# Altium project 飞思卡尔.PrjPCB
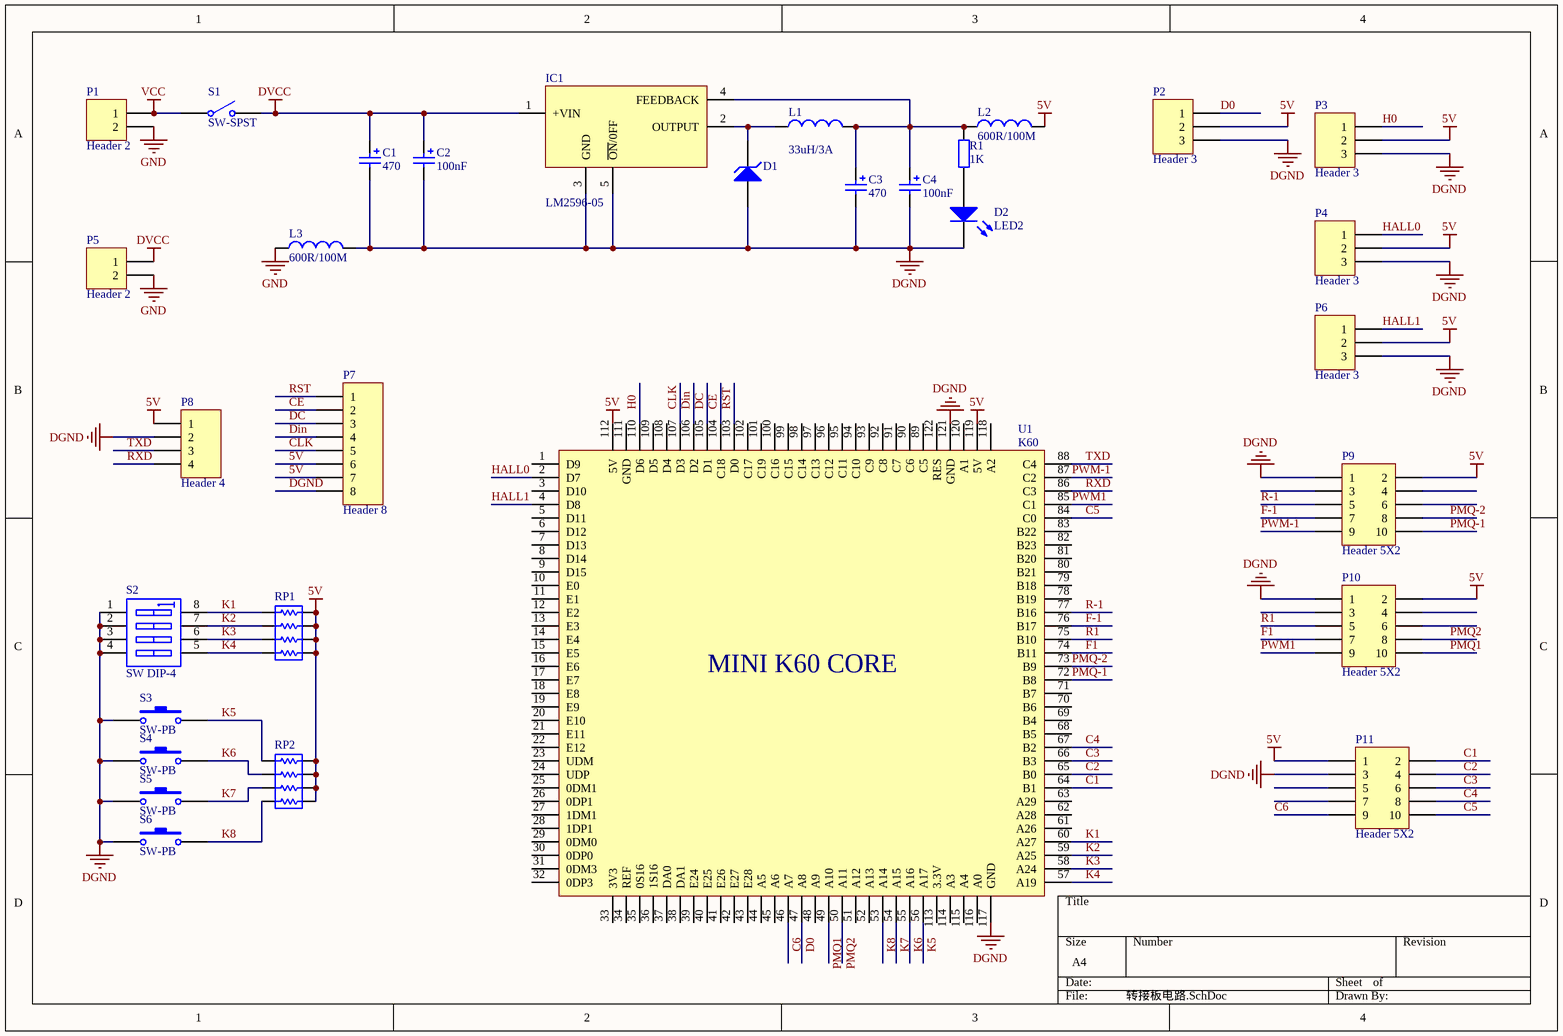
[diagram p0: 转接板电路.SchDoc]
1 sheet, 31 parts. Net scope: global (net labels, ports and power ports of the same name join across sheets).
Board file: 转接板PCB.PcbDoc

## Sheet 转接板电路.SchDoc
size A4

### Parts
C1  470  [ccc]
C2  value 100nF  [C0805]
C3  470  [ccc]
C4  value 100nF  [C0805]
D1  D Zener  [D1810]  (value not drawn)
D2  LED2  [D0805]
IC1  LM2596-05  [TO-263-5]
L1  value 33uH/3A  [L-12*12MM-S]  (hidden comment: Inductor)
L2  value 600R/100M  [L1206]  (hidden comment: Inductor)
L3  value 600R/100M  [L1206]  (hidden comment: Inductor)
P1  Header 2  [SIP2-1]
P2  Header 3  [SIP3]
P3  Header 3  [SIP3]
P4  Header 3  [SIP3]
P5  Header 2  [SIP2-1]
P6  Header 3  [SIP3]
P7  Header 8  [SIP8]
P8  Header 4  [SIP4]
P9  Header 5X2  [SIP10]
P10  Header 5X2  [SIP10]
P11  Header 5X2  [SIP10]
R1  value 1K  [R0805]  (hidden comment: Res2)
RP1  R  PAIZU  [8P4R-0805]  (value not drawn)
RP2  R  PAIZU  [8P4R-0805]  (value not drawn)
S1  SW-SPST  [PCBComponent_1]
S2  SW DIP-4  [BM-SW-4]
S3  SW-PB  [SW-SMD1]
S4  SW-PB  [SW-SMD1]
S5  SW-PB  [SW-SMD1]
S6  SW-PB  [SW-SMD1]
U1  K60  [K60-MK]

### Nets
5V: L2.2 P2.2 P3.2 P4.2 P6.2 P7.6 P7.7 P8.1 P9.2 P10.2 P11.1 RP1.5 RP1.6 RP1.7 RP1.8 RP2.5 RP2.6 RP2.7 RP2.8 U1.112(5V) U1.119(5V)
DGND: C1.2 C2.2 C3.2 C4.2 D1.1(A) D2.2(K) IC1.3(GND) IC1.5(~{ON}/0FF) L3.2 P2.3 P3.3 P4.3 P6.3 P7.8 P8.2 P9.1 P10.1 P11.3 S2.1(A1) S2.2(A2) S2.3(A3) S2.4(A4) S3.1 S4.1 S5.1 S6.1 U1.117(GND) U1.121(GND)
DVCC: C1.1 C2.1 IC1.1(+VIN) P5.1 S1.2(NO)
GND: L3.1 P1.2 P5.2
VCC: P1.1 S1.1(COMMON)
C1: P11.2 U1.64(B1)
C2: P11.4 U1.65(B0)
C3: P11.6 U1.66(B3)
C4: P11.8 U1.67(B2)
C5: P11.10 U1.84(C0)
C6: P11.9 U1.46(A7)
CE: P7.2 U1.104(C18)
CLK: P7.5 U1.107(D3)
D0: P2.1 U1.47(A8)
DC: P7.3 U1.105(D1)
Din: P7.4 U1.106(D2)
F1: P10.7 U1.74(B11)
F-1: P9.7 U1.76(B17)
H0: P3.1 U1.110(D6)
HALL0: P4.1 U1.2(D7)
HALL1: P6.1 U1.4(D8)
K1: RP1.1 S2.8(B1) U1.60(A27)
K2: RP1.2 S2.7(B2) U1.59(A25)
K3: RP1.3 S2.6(B3) U1.58(A24)
K4: RP1.4 S2.5(B4) U1.57(A19)
K5: RP2.1 S3.2 U1.56(A17)
K6: RP2.2 S4.2 U1.55(A16)
K7: RP2.3 S5.2 U1.54(A15)
K8: RP2.4 S6.2 U1.53(A14)
PMQ1: P10.10 U1.49(A10)
PMQ2: P10.8 U1.50(A11)
PMQ-1: P9.10 U1.72(B8)
PMQ-2: P9.8 U1.73(B9)
PWM1: P10.9 U1.85(C1)
PWM-1: P9.9 U1.87(C2)
R1: P10.5 U1.75(B10)
R-1: P9.5 U1.77(B16)
RST: P7.1 U1.103(D0)
RXD: P8.4 U1.86(C3)
TXD: P8.3 U1.88(C4)
NetC3_1: C3.1 C4.1 IC1.4(FEEDBACK) L1.2 L2.1 R1.1
NetD1_2: D1.2(K) IC1.2(OUTPUT) L1.1
NetD2_1: D2.1(A) R1.2

Not connected (* = marked no-connect by the designer): P9 3 4 6; P10 3 4 6; P11 5 7; U1 1(D9) 3(D10) 5(D11) 6(D12) 7(D13) 8(D14) 9(D15) 10(E0) 11(E1) 12(E2) 13(E3) 14(E4) 15(E5) 16(E6) 17(E7) 18(E8) 19(E9) 20(E10) 21(E11) 22(E12) 23(UDM) 24(UDP) 25(0DM1) 26(0DP1) 27(1DM1) 28(1DP1) 29(0DM0) 30(0DP0) 31(0DM3) 32(0DP3) 33(3V3) 34(REF) 35(0S16) 36(1S16) 37(DA0) 38(DA1) 39(E24) 40(E25) 41(E26) 42(E27) 43(E28) 44(A5) 45(A6) 48(A9) 51(A12) 52(A13) 61(A26) 62(A28) 63(A29) 68(B5) 69(B4) 70(B6) 71(B7) 78(B19) 79(B18) 80(B21) 81(B20) 82(B23) 83(B22) 89(C5) 90(C6) 91(C7) 92(C8) 93(C9) 94(C10) 95(C11) 96(C12) 97(C13) 98(C14) 99(C15) 100(C16) 101(C19) 102(C17) 108(D4) 109(D5) 111(GND) 113(3.3V) 114(A3) 115(A4) 116(A0) 118(A2) 120(A1) 122(RES)

### Notes on the sheet
- (in symbol K60) MINI K60 CORE

### Library data of the parts
C1 C3 = Cap Pol2: Polarized Capacitor (Axial); Value: 100pF; Published: 8-Jun-2000; LatestRevisionDate: 17-Jul-2002; LatestRevisionNote: Re-released for DXP Platform.; PackageReference: POLAR0.8; Publisher: Altium Limited
C2 C4 = Cap Pol2: Polarized Capacitor (Axial); Published: 8-Jun-2000; LatestRevisionDate: 17-Jul-2002; LatestRevisionNote: Re-released for DXP Platform.; PackageReference: POLAR0.8; Publisher: Altium Limited
D1 = D Zener: Zener Diode; Published: 8-Jun-2000; LatestRevisionDate: 17-Jul-2002; LatestRevisionNote: Re-released for DXP Platform.; PackageReference: DIODE-0.7; Publisher: Altium Limited
D2 = LED2: Typical RED, GREEN, YELLOW, AMBER GaAs LED; Published: 8-Jun-2000; LatestRevisionDate: 17-Jul-2002; LatestRevisionNote: Re-released for DXP Platform.; PackageVersion: Feb-2002; PackageReference: 3.2X1.6X1.1; Publisher: Altium Limited
L1-L3 = Inductor: Code_IEC: 1005; Published: 8-Jun-2000; LatestRevisionDate: 29-May-2009; LatestRevisionNote: IPC-7351 Footprint Added.; PackageReference: 0402-A; Publisher: Altium Limited; PackageDescription: Chip Inductor; Code_JEITA: 0402
P1 P5 = Header 2: Header, 2-Pin; LatestRevisionDate: 17-Jul-2002; LatestRevisionNote: Re-released for DXP Platform.; Publisher: Altium Limited
P2-P4 P6 = Header 3: Header, 3-Pin; LatestRevisionDate: 17-Jul-2002; LatestRevisionNote: Re-released for DXP Platform.; Publisher: Altium Limited
P7 = Header 8: Header, 8-Pin; LatestRevisionDate: 17-Jul-2002; LatestRevisionNote: Re-released for DXP Platform.; Publisher: Altium Limited
P8 = Header 4: Header, 4-Pin; LatestRevisionDate: 17-Jul-2002; LatestRevisionNote: Re-released for DXP Platform.; Publisher: Altium Limited
P9-P11 = Header 5X2: Header, 5-Pin, Dual row; LatestRevisionDate: 17-Jul-2002; LatestRevisionNote: Re-released for DXP Platform.; Publisher: Altium Limited
R1 = Res2: Resistor; Published: 8-Jun-2000; LatestRevisionDate: 17-Jul-2002; LatestRevisionNote: Re-released for DXP Platform.; PackageReference: AXIAL-0.4; Publisher: Altium Limited
S1 = SW-SPST: Single-Pole, Single-Throw Switch; Published: 24-Mar-1999; LatestRevisionDate: 17-Jul-2002; LatestRevisionNote: Re-released for DXP Platform.; PackageReference: SPST-2; Publisher: Altium Limited
S2 = SW DIP-4: DIP Switch, 4 Position, SPST; Published: 24-Mar-1999; LatestRevisionDate: 29-May-2009; LatestRevisionNote: IPC-7351 Footprint Added.; PackageVersion: Dec-2002; PackageReference: SO8; Publisher: Altium Limited; PackageDescription: 8-Pin Small Outline Integrated Circuit 1.27 mm Pitch; Code_JEDEC: MS-012-AA; Code_IPC: SOIC127P600-8
S3-S6 = SW-PB: Switch; Published: 24-Mar-1999; LatestRevisionDate: 17-Jul-2002; LatestRevisionNote: Re-released for DXP Platform.; PackageReference: SPST-2; Publisher: Altium Limited
RP1 RP2 = R  PAIZU: Published: 8-Jun-2000; LatestRevisionDate: 17-Jul-2002; LatestRevisionNote: Re-released for DXP Platform.; PackageReference: AXIAL-0.3; Publisher: Altium Limited